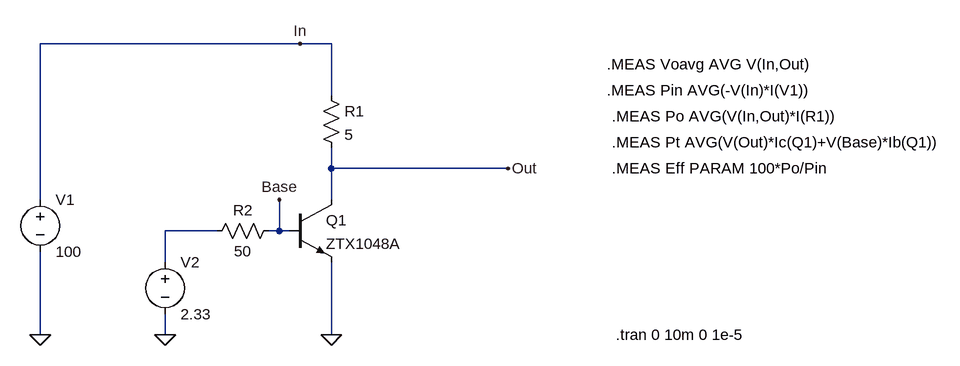
[diagram p0: schematic Linear.asc]
Linear.asc, the LTspice schematic file:
Version 4
SHEET 1 1464 680
WIRE 432 -112 32 -112
WIRE 480 -112 432 -112
WIRE 480 -32 480 -112
WIRE 480 80 480 48
WIRE 752 80 480 80
WIRE 32 128 32 -112
WIRE 480 128 480 80
WIRE 304 176 224 176
WIRE 400 176 400 128
WIRE 400 176 384 176
WIRE 416 176 400 176
WIRE 224 224 224 176
WIRE 32 336 32 208
WIRE 224 336 224 304
WIRE 480 336 480 224
FLAG 32 336 0
FLAG 480 336 0
FLAG 752 80 Out
FLAG 224 336 0
FLAG 432 -112 In
FLAG 400 128 Base
SYMBOL voltage 32 112 R0
WINDOW 123 0 0 Left 0
WINDOW 39 0 0 Left 0
SYMATTR InstName V1
SYMATTR Value 100
SYMBOL res 464 -48 R0
SYMATTR InstName R1
SYMATTR Value 5
SYMBOL npn 416 128 R0
SYMATTR InstName Q1
SYMATTR Value ZTX1048A
SYMBOL res 400 160 R90
WINDOW 0 0 56 VBottom 2
WINDOW 3 32 56 VTop 2
SYMATTR InstName R2
SYMATTR Value 50
SYMBOL voltage 224 208 R0
WINDOW 123 0 0 Left 0
WINDOW 39 0 0 Left 0
SYMATTR InstName V2
SYMATTR Value 2.33
TEXT 918 336 Left 2 !.tran 0 10m 0 1e-5
TEXT 904 -80 Left 2 !.MEAS Voavg AVG V(In,Out)
TEXT 904 -40 Left 2 !.MEAS Pin AVG(-V(In)*I(V1))
TEXT 912 0 Left 2 !.MEAS Po AVG(V(In,Out)*I(R1))
TEXT 912 40 Left 2 !.MEAS Pt AVG(V(Out)*Ic(Q1)+V(Base)*Ib(Q1))
TEXT 912 80 Left 2 !.MEAS Eff PARAM 100*Po/Pin

The netlist it stands for:
* Linear.asc
V1 In 0 100
R1 In Out 5
Q1 Out Base 0 0 ZTX1048A
R2 Base N001 50
V2 N001 0 2.33
.model NPN NPN
.model PNP PNP
.lib standard.bjt
.tran 0 10m 0 1e-5
.MEAS Voavg AVG V(In,Out)
.MEAS Pin AVG(-V(In)*I(V1))
.MEAS Po AVG(V(In,Out)*I(R1))
.MEAS Pt AVG(V(Out)*Ic(Q1)+V(Base)*Ib(Q1))
.MEAS Eff PARAM 100*Po/Pin
.backanno
.end